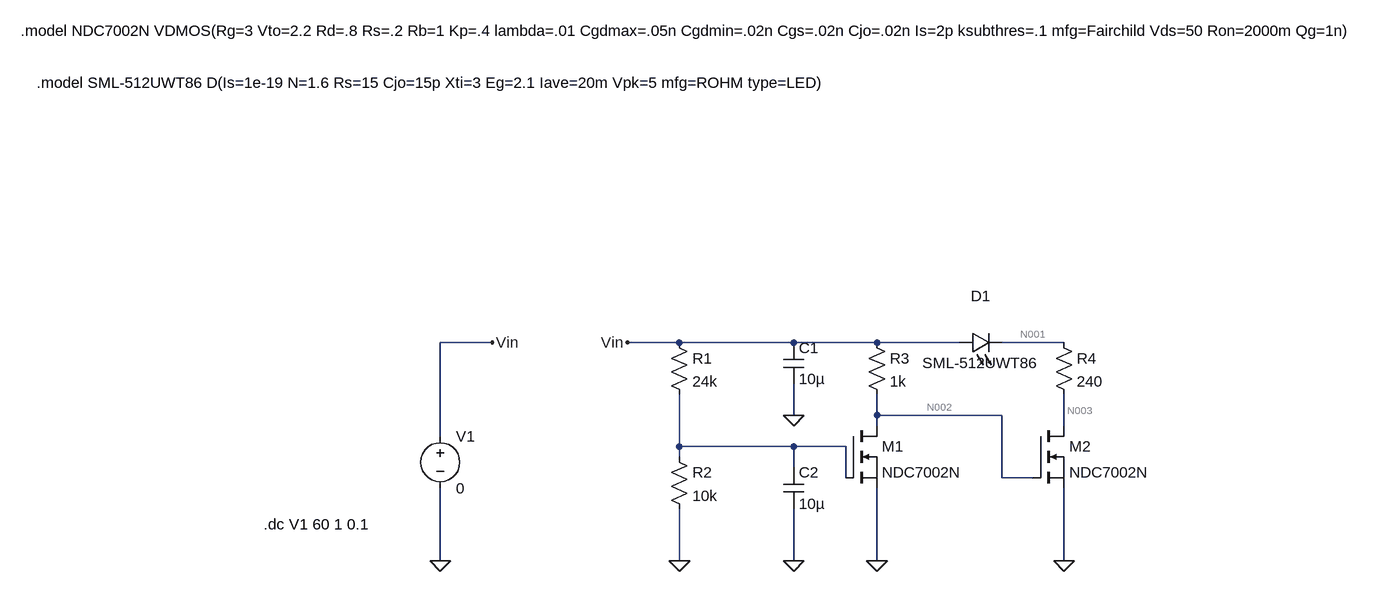
[diagram p0: schematic Discharge_sim.asc]
Discharge_sim.asc, the LTspice schematic file:
Version 4.1
SHEET 1 1296 680
WIRE -144 48 -224 48
WIRE 144 48 64 48
WIRE 320 48 144 48
WIRE 448 48 320 48
WIRE 576 48 448 48
WIRE 736 48 640 48
WIRE 320 160 320 112
WIRE 448 160 448 128
WIRE 640 160 448 160
WIRE 448 176 448 160
WIRE 736 176 736 128
WIRE -224 192 -224 48
WIRE 144 208 144 128
WIRE 320 208 144 208
WIRE 400 208 320 208
WIRE 144 224 144 208
WIRE 320 240 320 208
WIRE 400 256 400 208
WIRE 640 256 640 160
WIRE 688 256 640 256
WIRE -224 384 -224 272
WIRE 144 384 144 304
WIRE 320 384 320 304
WIRE 448 384 448 272
WIRE 736 384 736 272
FLAG 320 160 0
FLAG 320 384 0
FLAG 144 384 0
FLAG 448 384 0
FLAG 736 384 0
FLAG -224 384 0
FLAG -144 48 Vin
FLAG 64 48 Vin
SYMBOL res 128 32 R0
SYMATTR InstName R1
SYMATTR Value 24k
SYMBOL res 128 208 R0
SYMATTR InstName R2
SYMATTR Value 10k
SYMBOL res 432 32 R0
SYMATTR InstName R3
SYMATTR Value 1k
SYMBOL res 720 32 R0
SYMATTR InstName R4
SYMATTR Value 240
SYMBOL cap 304 48 R0
SYMATTR InstName C1
SYMATTR Value 10µ
SYMBOL cap 304 240 R0
SYMATTR InstName C2
SYMATTR Value 10µ
SYMBOL nmos 400 176 R0
SYMATTR InstName M1
SYMATTR Value NDC7002N
SYMBOL nmos 688 176 R0
SYMATTR InstName M2
SYMATTR Value NDC7002N
SYMBOL LED 576 64 R270
WINDOW 0 72 32 VTop 2
WINDOW 3 0 32 VBottom 2
SYMATTR InstName D1
SYMATTR Value SML-512UWT86
SYMBOL voltage -224 176 R0
SYMATTR InstName V1
SYMATTR Value 0
TEXT 168 -432 Center 2 !.model NDC7002N VDMOS(Rg=3 Vto=2.2 Rd=.8 Rs=.2 Rb=1 Kp=.4 lambda=.01 Cgdmax=.05n Cgdmin=.02n Cgs=.02n Cjo=.02n Is=2p ksubthres=.1 mfg=Fairchild Vds=50 Ron=2000m Qg=1n)
TEXT -232 -352 Center 2 !.model SML-512UWT86 D(Is=1e-19 N=1.6 Rs=15 Cjo=15p Xti=3 Eg=2.1 Iave=20m Vpk=5 mfg=ROHM type=LED)
TEXT -496 328 Left 2 !.dc V1 60 1 0.1

The netlist it stands for:
* Discharge_sim.asc
R1 Vin N004 24k
R2 N004 0 10k
R3 Vin N002 1k
R4 N001 N003 240
C1 Vin 0 10µ
C2 N004 0 10µ
M1 N002 N004 0 0 NDC7002N
M2 N003 N002 0 0 NDC7002N
D1 Vin N001 SML-512UWT86
V1 Vin 0 0
.model D D
.lib standard.dio
.model NMOS NMOS
.model PMOS PMOS
.lib standard.mos
.model NDC7002N VDMOS(Rg=3 Vto=2.2 Rd=.8 Rs=.2 Rb=1 Kp=.4 lambda=.01 Cgdmax=.05n Cgdmin=.02n Cgs=.02n Cjo=.02n Is=2p ksubthres=.1 mfg=Fairchild Vds=50 Ron=2000m Qg=1n)
.model SML-512UWT86 D(Is=1e-19 N=1.6 Rs=15 Cjo=15p Xti=3 Eg=2.1 Iave=20m Vpk=5 mfg=ROHM type=LED)
.dc V1 60 1 0.1
.backanno
.end

* Results of the author's LTspice run, read from the files saved beside the schematic
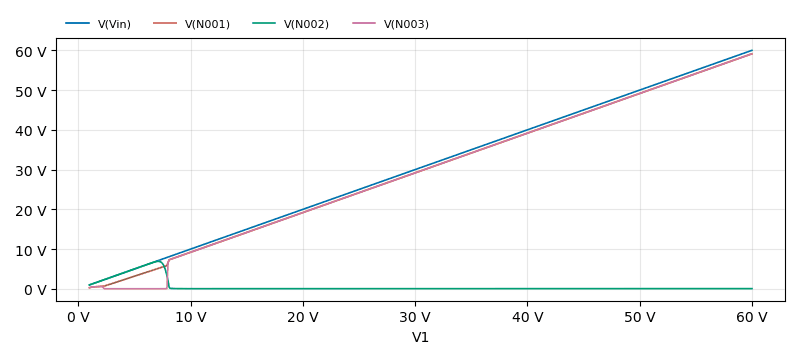
[diagram p1: DC transfer characteristic of Discharge_sim.asc, plotted from the saved traces]
* DC transfer characteristic, 1 run:
*   V(Vin): 60 V at V1=60 V, 1 V at V1=1 V, min 1 V, max 60 V
*   V(N001): 59.11 V at V1=60 V, 304.5 mV at V1=1 V, min 304.5 mV, max 59.11 V
*   V(N002): 69.64 mV at V1=60 V, 1 V at V1=1 V, min 31.94 mV, max 6.929 V
*   V(N003): 59.11 V at V1=60 V, 304.5 mV at V1=1 V, min 21.54 mV, max 59.11 V